# Altium schematic sheet Sheet1.SchDoc
size A4; SheetNumber: 1; SheetTotal: 2; SPICEModelCacheGQHKZIII: <root> / <DocumentId>GQHKZIII</DocumentId> / <CacheFrame Number="0"> / <Model Name="led3" Kind="MDL"> / <Text>*Typ BLUE SiC LED: Vf=3.4V Vr=5V If=40mA trr=3uS / *LED Pinout: 1=A, 2=K / .MODEL LED3 D (IS=93.1P RS=42M N=7.47 BV=5 IBV=30U / + CJO=2.97P VJ=.75 M=.333 TT=4.32U)</Text> / </Model> / </CacheFrame> / </root>
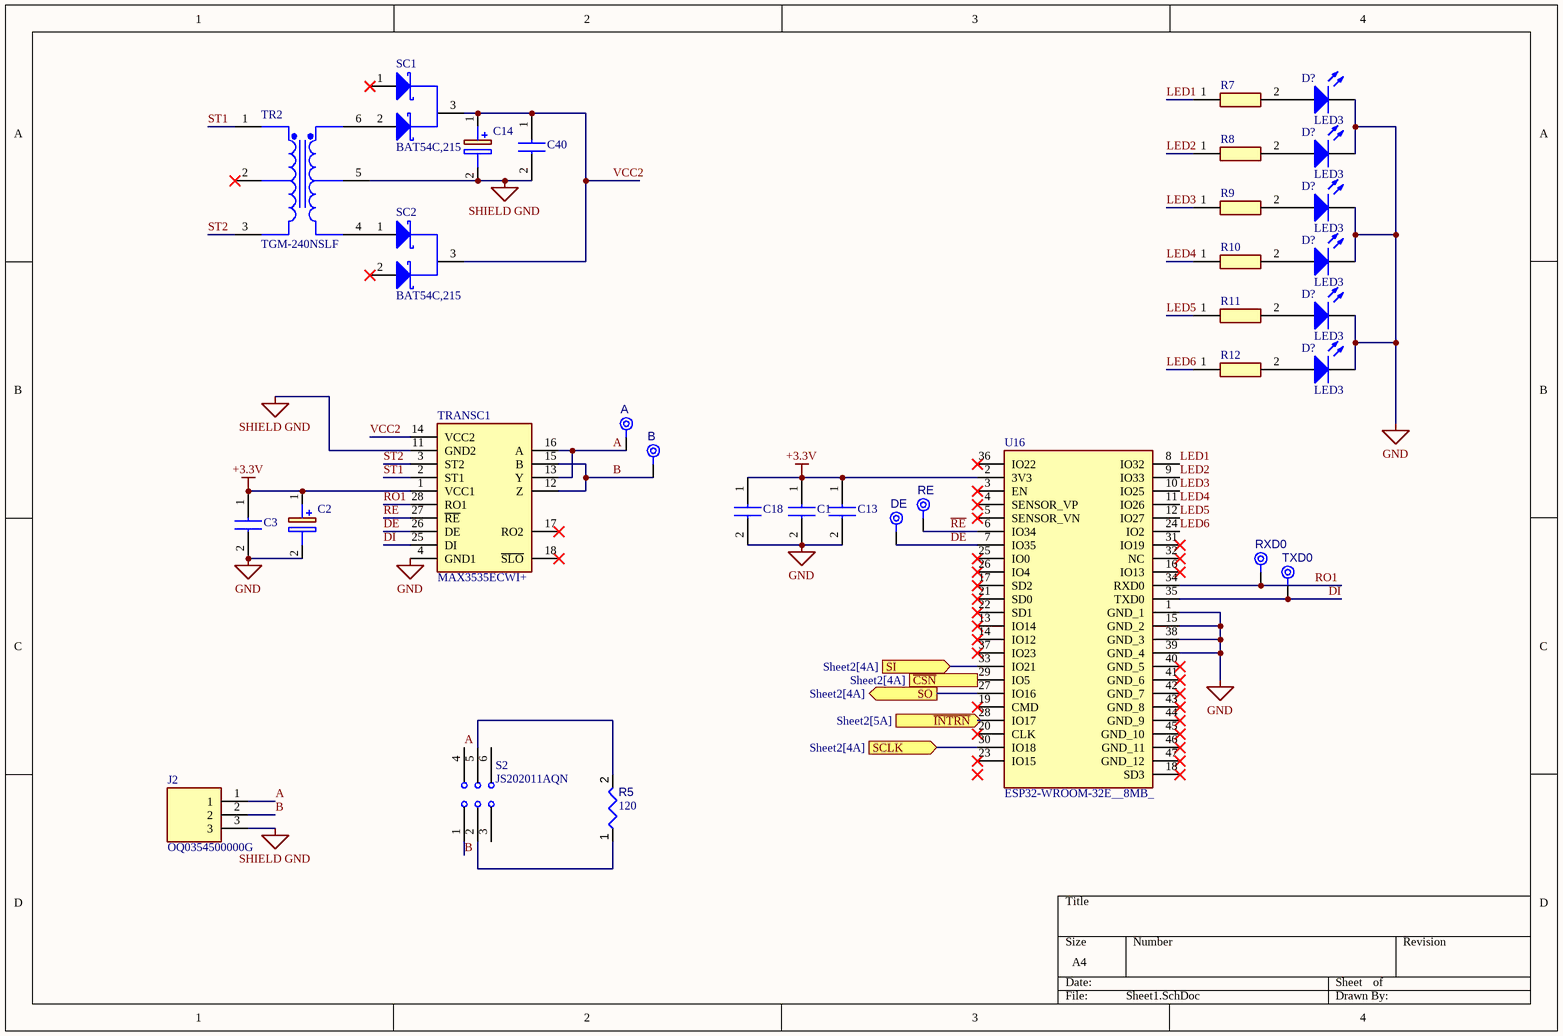
[diagram p0: Sheet1.SchDoc]

## Parts
(Parts that share a designator on the sheet are numbered #1, #2 ... from top to bottom, then left to right.)
A  TPAD6R  [TP06R]  (value not drawn)  (no BOM)
B  TPAD6R  [TP06R]  (value not drawn)  (no BOM)
C1  C1005X7R1C104KT  [CAPC1005X55N]  (value not drawn)
C2  EDH106M016A9BAA  [CAPAE430X565N]  (value not drawn)
C3  C1005X7R1C104KT  [CAPC1005X55N]  (value not drawn)
C13  CL05A106MP8NUB8  [CAPC1005X90N]  (value not drawn)
C14  EDH106M016A9BAA  [CAPAE430X565N]  (value not drawn)
C18  CL05B103KO5NNNC  [CAPC1005X55N]  (value not drawn)
C40  C1005X7R1C104KT  [CAPC1005X55N]  (value not drawn)
D?#1  LED3  [3.5X2.8X1.9]
D?#2  LED3  [3.5X2.8X1.9]
D?#3  LED3  [3.5X2.8X1.9]
D?#4  LED3  [3.5X2.8X1.9]
D?#5  LED3  [3.5X2.8X1.9]
D?#6  LED3  [3.5X2.8X1.9]
DE  TPAD6R  [TP06R]  (value not drawn)  (no BOM)
J2  OQ0354500000G  [SHDR3W100P0X508_1X3_1724X850X1200P]
R5  value 120  [RESC0805(2012)_L]  (hidden comment: RT0805FRE13120RL)
R7  RC0402FR-071KL  [RESC1005X40N]  (value not drawn)
R8  RC0402FR-071KL  [RESC1005X40N]  (value not drawn)
R9  RC0402FR-071KL  [RESC1005X40N]  (value not drawn)
R10  RC0402FR-071KL  [RESC1005X40N]  (value not drawn)
R11  RC0402FR-071KL  [RESC1005X40N]  (value not drawn)
R12  RC0402FR-071KL  [RESC1005X40N]  (value not drawn)
RE  TPAD6R  [TP06R]  (value not drawn)  (no BOM)
RXD0  TPAD6R  [TP06R]  (value not drawn)  (no BOM)
S2  JS202011AQN  [JS202011AQN]
SC1  BAT54C,215  [BAT54C215]
SC2  BAT54C,215  [BAT54C215]
TR2  TGM-240NSLF  [TGM240NSLF]
TRANSC1  MAX3535ECWI+  [MAX3535ECWI]
TXD0  TPAD6R  [TP06R]  (value not drawn)  (no BOM)
U16  ESP32-WROOM-32E__8MB_  [ESP32WROOM32E8MB]

## Ports
SCLK (in, see Sheet2[4A]), SI (in, see Sheet2[4A]), SO (out, see Sheet2[4A]), ~{CSN} (in, see Sheet2[4A]), ~{INTRN} (in, see Sheet2[5A])

## Nets
+3.3V: C1.1 C2.1(+) C3.1 C13.1 C18.1 TRANSC1.1(VCC1) U16.2(3V3)
GND: C1.2 C2.2(-) C3.2 C13.2 C18.2 D?#1.2(K) D?#2.2(K) D?#3.2(K) D?#4.2(K) D?#5.2(K) D?#6.2(K) TRANSC1.4(GND1) U16.1(GND_1) U16.15(GND_2) U16.38(GND_3) U16.39(GND_4)
SHIELD GND: C14.2(-) C40.2 J2.3 TR2.5(SEC_2) TRANSC1.11(GND2)
~{CSN}: U16.29(IO5) ; port ~{CSN}
~{INTRN}: U16.28(IO17) ; port ~{INTRN}
~{RE}: RE.1(TP) TRANSC1.27(~{RE}) U16.6(IO34)
A: A.1(TP) J2.1 S2.4(NC_2) TRANSC1.13(Y) TRANSC1.16(A)
B: B.1(TP) J2.2 S2.1(NC_1) TRANSC1.12(Z) TRANSC1.15(B)
DE: DE.1(TP) TRANSC1.26(DE) U16.7(IO35)
DI: TRANSC1.25(DI) TXD0.1(TP) U16.35(TXD0)
LED1: R7.1 U16.8(IO32)
LED2: R8.1 U16.9(IO33)
LED3: R9.1 U16.10(IO25)
LED4: R10.1 U16.11(IO26)
LED5: R11.1 U16.12(IO27)
LED6: R12.1 U16.24(IO2)
RO1: RXD0.1(TP) TRANSC1.28(RO1) U16.34(RXD0)
SCLK: U16.30(IO18) ; port SCLK
SI: U16.33(IO21) ; port SI
SO: U16.27(IO16) ; port SO
ST1: TR2.1(PRI_1) TRANSC1.2(ST1)
ST2: TR2.3(PRI_3) TRANSC1.3(ST2)
VCC2: C14.1(+) C40.1 SC1.3(COMMON_CATHODE) SC2.3(COMMON_CATHODE) TRANSC1.14(VCC2)
NetD?#1_1: D?#1.1(A) R7.2
NetD?#2_1: D?#2.1(A) R8.2
NetD?#3_1: D?#3.1(A) R9.2
NetD?#4_1: D?#4.1(A) R10.2
NetD?#5_1: D?#5.1(A) R11.2
NetD?#6_1: D?#6.1(A) R12.2
NetR5_1: R5.1 S2.2(C_1)
NetR5_2: R5.2 S2.5(C_2)
NetSC1_2: SC1.2(ANODE_2) TR2.6(SEC_3)
NetSC2_1: SC2.1(ANODE_1) TR2.4(SEC_1)

Not connected (* = marked no-connect by the designer): S2 3(NO_1) 6(NO_2); SC1 1(ANODE_1)*; SC2 2(ANODE_2)*; TR2 2(PRI_2)*; TRANSC1 17(RO2)* 18(~{SLO})*; U16 3(EN)* 4(SENSOR_VP)* 5(SENSOR_VN)* 13(IO14)* 14(IO12)* 16(IO13)* 17(SD2)* 18(SD3)* 19(CMD)* 20(CLK)* 21(SD0)* 22(SD1)* 23(IO15)* 25(IO0)* 26(IO4)* 31(IO19)* 32(NC)* 36(IO22)* 37(IO23)* 40(GND_5)* 41(GND_6)* 42(GND_7)* 43(GND_8)* 44(GND_9)* 45(GND_10)* 46(GND_11)* 47(GND_12)*

## Library data of the parts
A B DE RE RXD0 TXD0 = CMP-00028-00002-2: 0.6mm round; Pins: 1
C1 = C1005X7R1C104KT: Capacitor; Manufacturer_Name: TDK; Datasheet Link: https://product.tdk.com/en/system/files?file=dam/doc/product/capacitor/ceramic/mlcc/specification/mlccspec_commercial_general_midvoltage_en.pdf; Height: 0.55mm; Manufacturer_Part_Number: C1005X7R1C104KT; Mouser Part Number: N/A; Mouser Price/Stock: https://www.mouser.co.uk/ProductDetail/TDK/C1005X7R1C104KT?qs=cdpe0LUyr8DJnVp5QbU7dQ%3D%3D
C2 C14 = EDH106M016A9BAA: Capacitor Polarised 10u; Manufacturer_Name: KEMET; Datasheet Link: https://content.kemet.com/datasheets/KEM_A4049_EDH.pdf; Height: 5.65mm; Manufacturer_Part_Number: EDH106M016A9BAA; Mouser Part Number: 80-EDH106M016A9BAA; Mouser Price/Stock: https://www.mouser.co.uk/ProductDetail/KEMET/EDH106M016A9BAA?qs=iR2ablhfrmGRSCLQdrL4eg%3D%3D; Arrow Part Number: EDH106M016A9BAA; Arrow Price/Stock: https://www.arrow.com/en/products/edh106m016a9baa/kemet-corporation?utm_currency=USD&region=nac
C3 C40 = C1005X7R1C104KT: Capacitor 100n; Manufacturer_Name: TDK; Datasheet Link: https://product.tdk.com/en/system/files?file=dam/doc/product/capacitor/ceramic/mlcc/specification/mlccspec_commercial_general_midvoltage_en.pdf; Height: 0.55mm; Manufacturer_Part_Number: C1005X7R1C104KT; Mouser Part Number: N/A; Mouser Price/Stock: https://www.mouser.co.uk/ProductDetail/TDK/C1005X7R1C104KT?qs=cdpe0LUyr8DJnVp5QbU7dQ%3D%3D
C13 = CL05A106MP8NUB8: Capacitor; Manufacturer_Name: SAMSUNG; Datasheet Link: https://datasheet.datasheetarchive.com/originals/distributors/DKDS-19/372904.pdf; Height: 0.9mm; Manufacturer_Part_Number: CL05A106MP8NUB8; Mouser Part Number: 187-CL05A106MP8NUB8; Mouser Price/Stock: https://www.mouser.co.uk/ProductDetail/Samsung-Electro-Mechanics/CL05A106MP8NUB8?qs=W0yvOO0ixfHmpNLt1Po66A%3D%3D; Arrow Part Number: CL05A106MP8NUB8; Arrow Price/Stock: https://www.arrow.com/en/products/cl05a106mp8nub8/samsung-electro-mechanics?region=nac
C18 = CL05B103KO5NNNC: Capacitor 10n; Manufacturer_Name: SAMSUNG; Datasheet Link: https://mouser.componentsearchengine.com/Datasheets/2/CL05B103KO5NNNC.pdf; Height: 0.55mm; Manufacturer_Part_Number: CL05B103KO5NNNC; Mouser Part Number: N/A; Mouser Price/Stock: https://www.mouser.co.uk/ProductDetail/Samsung-Electro-Mechanics/CL05B103KO5NNNC?qs=349EhDEZ59r%252BGo7Nl8uX3w%3D%3D; Arrow Part Number: CL05B103KO5NNNC; Arrow Price/Stock: https://www.arrow.com/en/products/cl05b103ko5nnnc/samsung-electro-mechanics
D?#1-D?#6 = LED3: Typical BLUE SiC LED; Published: 8-Jun-2000; LatestRevisionDate: 17-Dec-2003; LatestRevisionNote: PCB Footprint replaced.; DatasheetVersion: 16-Apr-2002; PackageVersion: 16-Apr-2002; PackageReference: 3.5X2.8X1.9; Publisher: Altium Limited; PackageDescription: SM LED; 2 C-Bend Leads; Body 3.5 x 2.8 x 1.9 mm, inc leads (LxWxH typ)
J2 = OQ0354500000G: Connector; Manufacturer_Name: Amphenol; Datasheet Link: https://eu.mouser.com/datasheet/2/18/d2o_sm_TN_Hw-1379590.pdf; Height: 12mm; Manufacturer_Part_Number: OQ0354500000G; Mouser Part Number: 649-OQ03545000J0G; Mouser Price/Stock: https://www.mouser.co.uk/ProductDetail/Amphenol-Anytek/OQ0354500000G?qs=Mv7BduZupUhmrBj3wUKIQQ%3D%3D; Arrow Part Number: OQ0354500000G; Arrow Price/Stock: https://www.arrow.com/en/products/oq0354500000g/amphenol?region=nac
R5 = CMP-009-00174-3: Chip Resistor 120 ohms +1%; Tolerance: 5%; Power: 125mW; Max Operating Temperature: 155°C; Case/Package: 0805; Min Operating Temperature: -55°C; Pins: 2
R7-R12 = RC0402FR-071KL: Resistor; Manufacturer_Name: YAGEO; Datasheet Link: https://componentsearchengine.com/Datasheets/2/RC0402FR-071KL.pdf; Height: 0.4mm; Manufacturer_Part_Number: RC0402FR-071KL; Mouser Part Number: 603-RC0402FR-071KL; Mouser Price/Stock: https://www.mouser.co.uk/ProductDetail/YAGEO/RC0402FR-071KL?qs=V1yeUXFNrknDEmWLmm5v6g%3D%3D; Arrow Part Number: RC0402FR-071KL; Arrow Price/Stock: null?region=nac
S2 = JS202011AQN: Switch; Manufacturer_Name: C & K COMPONENTS; Datasheet Link: https://www.ckswitches.com/media/1422/js.pdf; Height: 3mm; Manufacturer_Part_Number: JS202011AQN; Mouser Part Number: 611-JS202011AQN; Mouser Price/Stock: https://www.mouser.co.uk/ProductDetail/CK/JS202011AQN?qs=LgMIjt8LuD%252Bmsz6wAeWWtQ%3D%3D; Arrow Part Number: JS202011AQN; Arrow Price/Stock: https://www.arrow.com/en/products/js202011aqn/ck?region=europe
SC1 SC2 = BAT54C,215: Schottky Diode; Manufacturer_Name: Nexperia; Datasheet Link: https://assets.nexperia.com/documents/data-sheet/BAT54_SER.pdf; Height: 1.1mm; Manufacturer_Part_Number: BAT54C,215; Mouser Part Number: 771-BAT54C-T/R; Mouser Price/Stock: https://www.mouser.co.uk/ProductDetail/Nexperia/BAT54C215?qs=me8TqzrmIYV5SKKt13YKQA%3D%3D; Arrow Part Number: BAT54C,215; Arrow Price/Stock: https://www.arrow.com/en/products/bat54c215/nexperia?region=europe
TR2 = TGM-240NSLF: Connector; Manufacturer_Name: Halo Electronics; Datasheet Link: https://componentsearchengine.com/Datasheets/1/TGM-240NSLF.pdf; Height: 5.08mm; Manufacturer_Part_Number: TGM-240NSLF; Mouser Part Number: 493-TGM-240NSLF; Mouser Price/Stock: https://www.mouser.co.uk/ProductDetail/HALO-Electronics/TGM-240NSLF?qs=8uu3sA0mUdvq2J2JpT2Sjg%3D%3D
TRANSC1 = MAX3535ECWI+: Integrated Circuit; Manufacturer_Name: Analog Devices; Datasheet Link: https://datasheets.maximintegrated.com/en/ds/MAX3535E-MXL1535E.pdf; Height: 2.65mm; Manufacturer_Part_Number: MAX3535ECWI+; Mouser Part Number: 700-MAX3535ECWI; Mouser Price/Stock: https://www.mouser.co.uk/ProductDetail/Analog-Devices-Maxim-Integrated/MAX3535ECWI%2b?qs=1THa7WoU59GttcgUwE66Fg%3D%3D
U16 = ESP32-WROOM-32E__8MB_: Integrated Circuit; Manufacturer_Name: Espressif Systems; Manufacturer_Part_Number: ESP32-WROOM-32E (8MB); Datasheet Link: https://www.espressif.com/sites/default/files/documentation/esp32-wroom-32_datasheet_en.pdf; Height: 3.2mm; Mouser Part Number: 356-ESP32WRM32E164PH; Mouser Price/Stock: https://www.mouser.co.uk/ProductDetail/Espressif-Systems/ESP32-WROOM-32E-8MB?qs=GBLSl2AkirsjshqvD9slKA%3D%3D